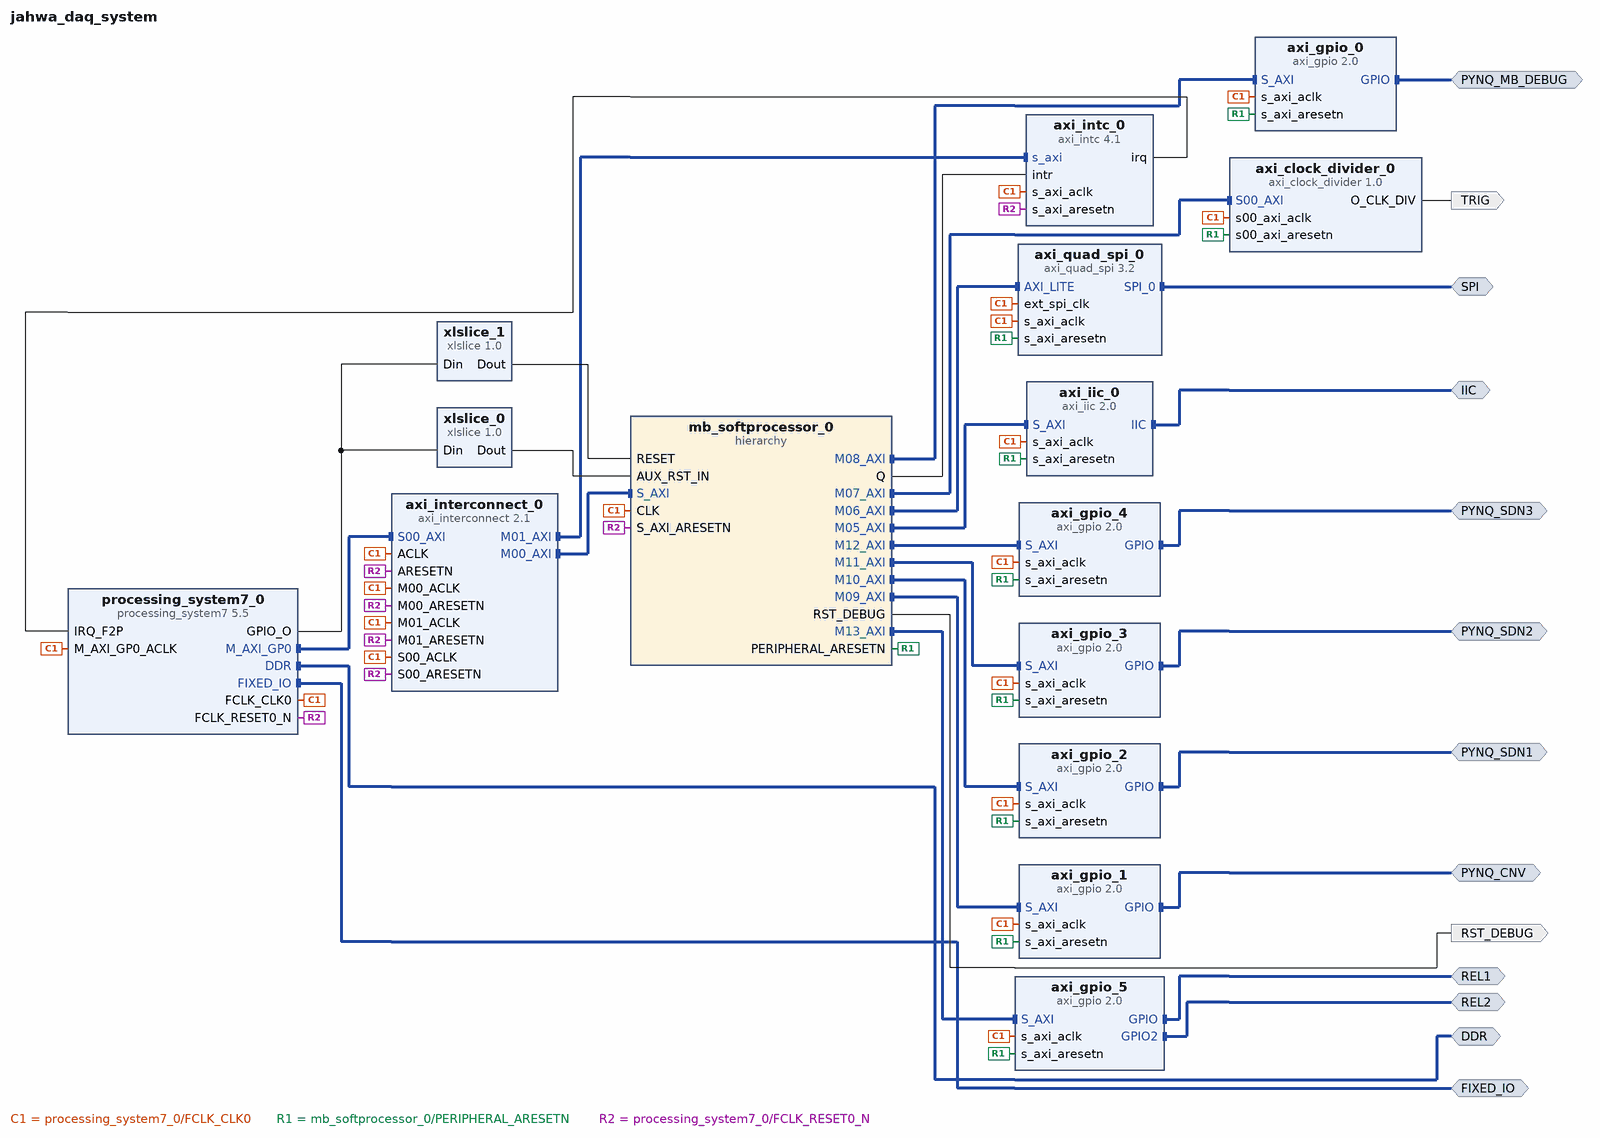
[diagram p0: block diagram of the top level]
# Vivado block design jahwa_daq_system, xc7z020clg400-1, Vivado 2020.2
create_bd_design jahwa_daq_system

create_bd_intf_port -mode Master -vlnv xilinx.com:interface:ddrx_rtl:1.0 DDR
create_bd_intf_port -mode Master -vlnv xilinx.com:display_processing_system7:fixedio_rtl:1.0 FIXED_IO
create_bd_intf_port -mode Master -vlnv xilinx.com:interface:spi_rtl:1.0 SPI
create_bd_intf_port -mode Master -vlnv xilinx.com:interface:iic_rtl:1.0 IIC
create_bd_intf_port -mode Master -vlnv xilinx.com:interface:gpio_rtl:1.0 PYNQ_CNV
create_bd_intf_port -mode Master -vlnv xilinx.com:interface:gpio_rtl:1.0 PYNQ_SDN1
create_bd_intf_port -mode Master -vlnv xilinx.com:interface:gpio_rtl:1.0 PYNQ_SDN2
create_bd_intf_port -mode Master -vlnv xilinx.com:interface:gpio_rtl:1.0 PYNQ_SDN3
create_bd_intf_port -mode Master -vlnv xilinx.com:interface:gpio_rtl:1.0 REL1
create_bd_intf_port -mode Master -vlnv xilinx.com:interface:gpio_rtl:1.0 REL2
create_bd_intf_port -mode Master -vlnv xilinx.com:interface:gpio_rtl:1.0 PYNQ_MB_DEBUG
create_bd_port -dir O RST_DEBUG
create_bd_port -dir O TRIG

create_bd_cell -type ip -vlnv xilinx.com:ip:processing_system7:5.5 processing_system7_0
set_property -dict [list \
  CONFIG.PCW_APU_PERIPHERAL_FREQMHZ 650 \
  CONFIG.PCW_CRYSTAL_PERIPHERAL_FREQMHZ 50 \
  CONFIG.PCW_ENET0_ENET0_IO {MIO 16 .. 27} \
  CONFIG.PCW_ENET0_GRP_MDIO_ENABLE 1 \
  CONFIG.PCW_ENET0_GRP_MDIO_IO {MIO 52 .. 53} \
  CONFIG.PCW_ENET0_PERIPHERAL_ENABLE 1 \
  CONFIG.PCW_ENET0_RESET_ENABLE 1 \
  CONFIG.PCW_ENET0_RESET_IO {MIO 9} \
  CONFIG.PCW_ENET_RESET_ENABLE 1 \
  CONFIG.PCW_ENET_RESET_SELECT {Share reset pin} \
  CONFIG.PCW_FPGA0_PERIPHERAL_FREQMHZ 100 \
  CONFIG.PCW_FPGA1_PERIPHERAL_FREQMHZ 50 \
  CONFIG.PCW_GPIO_EMIO_GPIO_ENABLE 1 \
  CONFIG.PCW_GPIO_EMIO_GPIO_IO 2 \
  CONFIG.PCW_GPIO_EMIO_GPIO_WIDTH 2 \
  CONFIG.PCW_GPIO_MIO_GPIO_ENABLE 1 \
  CONFIG.PCW_GPIO_MIO_GPIO_IO MIO \
  CONFIG.PCW_I2C_RESET_ENABLE 1 \
  CONFIG.PCW_IRQ_F2P_INTR 1 \
  CONFIG.PCW_M_AXI_GP0_FREQMHZ 10 \
  CONFIG.PCW_PERIPHERAL_BOARD_PRESET None \
  CONFIG.PCW_PRESET_BANK1_VOLTAGE {LVCMOS 1.8V} \
  CONFIG.PCW_QSPI_GRP_FBCLK_ENABLE 1 \
  CONFIG.PCW_QSPI_GRP_FBCLK_IO {MIO 8} \
  CONFIG.PCW_QSPI_GRP_SINGLE_SS_ENABLE 1 \
  CONFIG.PCW_QSPI_GRP_SINGLE_SS_IO {MIO 1 .. 6} \
  CONFIG.PCW_QSPI_PERIPHERAL_ENABLE 1 \
  CONFIG.PCW_QSPI_QSPI_IO {MIO 1 .. 6} \
  CONFIG.PCW_SD0_GRP_CD_ENABLE 1 \
  CONFIG.PCW_SD0_GRP_CD_IO {MIO 47} \
  CONFIG.PCW_SD0_GRP_WP_ENABLE 0 \
  CONFIG.PCW_SD0_PERIPHERAL_ENABLE 1 \
  CONFIG.PCW_SD0_SD0_IO {MIO 40 .. 45} \
  CONFIG.PCW_SDIO_PERIPHERAL_FREQMHZ 50 \
  CONFIG.PCW_SINGLE_QSPI_DATA_MODE x4 \
  CONFIG.PCW_UART0_PERIPHERAL_ENABLE 1 \
  CONFIG.PCW_UART0_UART0_IO {MIO 14 .. 15} \
  CONFIG.PCW_UART1_PERIPHERAL_ENABLE 0 \
  CONFIG.PCW_UART_PERIPHERAL_FREQMHZ 100 \
  CONFIG.PCW_UIPARAM_DDR_BUS_WIDTH {16 Bit} \
  CONFIG.PCW_UIPARAM_DDR_FREQ_MHZ 525 \
  CONFIG.PCW_UIPARAM_DDR_PARTNO {MT41J256M16 RE-125} \
  CONFIG.PCW_USB0_PERIPHERAL_ENABLE 1 \
  CONFIG.PCW_USB0_RESET_ENABLE 1 \
  CONFIG.PCW_USB0_RESET_IO {MIO 46} \
  CONFIG.PCW_USB0_USB0_IO {MIO 28 .. 39} \
  CONFIG.PCW_USB_RESET_ENABLE 1 \
  CONFIG.PCW_USB_RESET_SELECT {Share reset pin} \
  CONFIG.PCW_USE_FABRIC_INTERRUPT 1 \
] [get_bd_cells processing_system7_0]
# 490 more settings of processing_system7_0 are not shown: defaults, MIO pin electricals, DDR timing, and values the tool derives
create_bd_cell -type ip -vlnv xilinx.com:ip:axi_intc:4.1 axi_intc_0
create_bd_cell -type ip -vlnv xilinx.com:ip:axi_iic:2.0 axi_iic_0
set_property -dict {CONFIG.C_SDA_LEVEL 0 CONFIG.IIC_FREQ_KHZ 1000} [get_bd_cells axi_iic_0]
create_bd_cell -type ip -vlnv xilinx.com:ip:axi_quad_spi:3.2 axi_quad_spi_0
set_property -dict [list \
  CONFIG.C_NUM_SS_BITS 2 \
  CONFIG.C_NUM_TRANSFER_BITS 16 \
  CONFIG.C_SCK_RATIO 16 \
  CONFIG.C_USE_STARTUP 0 \
] [get_bd_cells axi_quad_spi_0]
create_bd_cell -type ip -vlnv xilinx.com:ip:axi_gpio:2.0 axi_gpio_0
set_property -dict {CONFIG.C_ALL_OUTPUTS 1 CONFIG.C_GPIO_WIDTH 4} [get_bd_cells axi_gpio_0]
create_bd_cell -type ip -vlnv xilinx.com:ip:axi_gpio:2.0 axi_gpio_1
set_property -dict {CONFIG.C_ALL_OUTPUTS 1 CONFIG.C_GPIO_WIDTH 1} [get_bd_cells axi_gpio_1]
create_bd_cell -type ip -vlnv xilinx.com:ip:axi_gpio:2.0 axi_gpio_2
set_property -dict {CONFIG.C_ALL_OUTPUTS 1 CONFIG.C_GPIO_WIDTH 1} [get_bd_cells axi_gpio_2]
create_bd_cell -type ip -vlnv xilinx.com:ip:axi_gpio:2.0 axi_gpio_3
set_property -dict {CONFIG.C_ALL_OUTPUTS 1 CONFIG.C_GPIO_WIDTH 1} [get_bd_cells axi_gpio_3]
create_bd_cell -type ip -vlnv xilinx.com:ip:axi_gpio:2.0 axi_gpio_4
set_property -dict {CONFIG.C_ALL_OUTPUTS 1 CONFIG.C_GPIO_WIDTH 1} [get_bd_cells axi_gpio_4]
create_bd_cell -type ip -vlnv xilinx.com:ip:axi_gpio:2.0 axi_gpio_5
set_property -dict [list \
  CONFIG.C_ALL_OUTPUTS 1 \
  CONFIG.C_ALL_OUTPUTS_2 1 \
  CONFIG.C_GPIO2_WIDTH 1 \
  CONFIG.C_GPIO_WIDTH 1 \
  CONFIG.C_IS_DUAL 1 \
] [get_bd_cells axi_gpio_5]
create_bd_cell -type ip -vlnv xilinx.com:ip:axi_interconnect:2.1 axi_interconnect_0
set_property -dict {CONFIG.NUM_MI 2} [get_bd_cells axi_interconnect_0]
create_bd_cell -type ip -vlnv xilinx.com:ip:xlslice:1.0 xlslice_0
set_property -dict {CONFIG.DIN_WIDTH 2} [get_bd_cells xlslice_0]
create_bd_cell -type ip -vlnv xilinx.com:ip:xlslice:1.0 xlslice_1
set_property -dict {CONFIG.DIN_FROM 1 CONFIG.DIN_TO 1 CONFIG.DIN_WIDTH 2} [get_bd_cells xlslice_1]
create_bd_cell -type hier mb_softprocessor_0
create_bd_cell -type ip -vlnv xilinx.com:user:axi_clock_divider:1.0 axi_clock_divider_0

# ---- hierarchy /mb_softprocessor_0 ----
current_bd_instance /mb_softprocessor_0
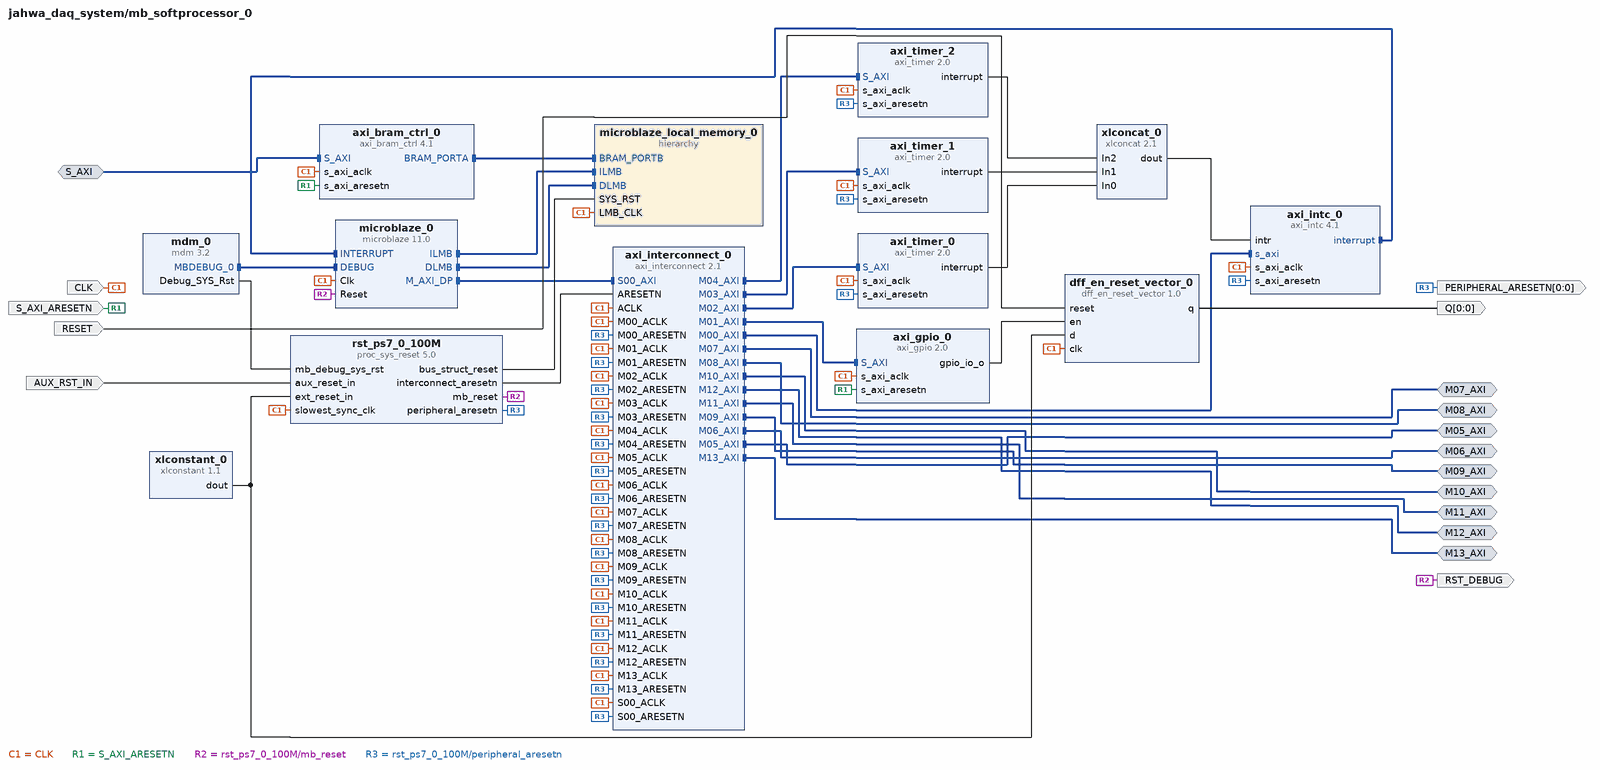
[diagram p1: block diagram inside /mb_softprocessor_0]
create_bd_intf_pin -mode Slave -vlnv xilinx.com:interface:aximm_rtl:1.0 S_AXI
create_bd_intf_pin -mode Master -vlnv xilinx.com:interface:aximm_rtl:1.0 M05_AXI
create_bd_intf_pin -mode Master -vlnv xilinx.com:interface:aximm_rtl:1.0 M06_AXI
create_bd_intf_pin -mode Master -vlnv xilinx.com:interface:aximm_rtl:1.0 M07_AXI
create_bd_intf_pin -mode Master -vlnv xilinx.com:interface:aximm_rtl:1.0 M08_AXI
create_bd_intf_pin -mode Master -vlnv xilinx.com:interface:aximm_rtl:1.0 M09_AXI
create_bd_intf_pin -mode Master -vlnv xilinx.com:interface:aximm_rtl:1.0 M10_AXI
create_bd_intf_pin -mode Master -vlnv xilinx.com:interface:aximm_rtl:1.0 M11_AXI
create_bd_intf_pin -mode Master -vlnv xilinx.com:interface:aximm_rtl:1.0 M12_AXI
create_bd_intf_pin -mode Master -vlnv xilinx.com:interface:aximm_rtl:1.0 M13_AXI
create_bd_pin -dir I RESET
create_bd_pin -dir I -type clk CLK
create_bd_pin -dir I -type rst AUX_RST_IN
create_bd_pin -dir I -type rst S_AXI_ARESETN
create_bd_pin -dir O -from 0 -to 0 Q
create_bd_pin -dir O -type rst RST_DEBUG
create_bd_pin -dir O -from 0 -to 0 -type rst PERIPHERAL_ARESETN

create_bd_cell -type ip -vlnv xilinx.com:ip:axi_bram_ctrl:4.1 axi_bram_ctrl_0
set_property -dict {CONFIG.READ_LATENCY 1 CONFIG.SINGLE_PORT_BRAM 1} [get_bd_cells axi_bram_ctrl_0]
create_bd_cell -type ip -vlnv xilinx.com:ip:axi_gpio:2.0 axi_gpio_0
set_property -dict {CONFIG.C_ALL_OUTPUTS 1 CONFIG.C_GPIO_WIDTH 1 CONFIG.C_IS_DUAL 0} [get_bd_cells axi_gpio_0]
create_bd_cell -type ip -vlnv xilinx.com:ip:axi_timer:2.0 axi_timer_0
set_property -dict {CONFIG.enable_timer2 1} [get_bd_cells axi_timer_0]
create_bd_cell -type ip -vlnv xilinx.com:ip:axi_timer:2.0 axi_timer_1
set_property -dict {CONFIG.enable_timer2 1} [get_bd_cells axi_timer_1]
create_bd_cell -type ip -vlnv xilinx.com:ip:axi_timer:2.0 axi_timer_2
set_property -dict {CONFIG.mode_64bit 1} [get_bd_cells axi_timer_2]
create_bd_cell -type ip -vlnv xilinx.com:ip:xlconcat:2.1 xlconcat_0
set_property -dict {CONFIG.NUM_PORTS 3} [get_bd_cells xlconcat_0]
create_bd_cell -type ip -vlnv xilinx.com:ip:axi_intc:4.1 axi_intc_0
create_bd_cell -type ip -vlnv xilinx.com:ip:axi_interconnect:2.1 axi_interconnect_0
set_property -dict {CONFIG.NUM_MI 14} [get_bd_cells axi_interconnect_0]
create_bd_cell -type ip -vlnv xilinx.com:user:dff_en_reset_vector:1.0 dff_en_reset_vector_0
set_property -dict {CONFIG.SIZE 1} [get_bd_cells dff_en_reset_vector_0]
create_bd_cell -type ip -vlnv xilinx.com:ip:mdm:3.2 mdm_0
create_bd_cell -type ip -vlnv xilinx.com:ip:microblaze:11.0 microblaze_0
set_property -dict [list \
  CONFIG.C_ADDR_TAG_BITS 0 \
  CONFIG.C_DCACHE_ADDR_TAG 0 \
  CONFIG.C_DEBUG_ENABLED 1 \
  CONFIG.C_D_AXI 1 \
  CONFIG.C_D_LMB 1 \
  CONFIG.C_I_LMB 1 \
  CONFIG.C_USE_DCACHE 0 \
  CONFIG.C_USE_ICACHE 0 \
] [get_bd_cells microblaze_0]
create_bd_cell -type ip -vlnv xilinx.com:ip:proc_sys_reset:5.0 rst_ps7_0_100M
set_property -dict {CONFIG.C_AUX_RESET_HIGH 1} [get_bd_cells rst_ps7_0_100M]
create_bd_cell -type ip -vlnv xilinx.com:ip:xlconstant:1.1 xlconstant_0
set_property -dict {CONFIG.CONST_VAL 1} [get_bd_cells xlconstant_0]
create_bd_cell -type hier microblaze_local_memory_0

# ---- hierarchy /mb_softprocessor_0/microblaze_local_memory_0 ----
current_bd_instance /mb_softprocessor_0/microblaze_local_memory_0
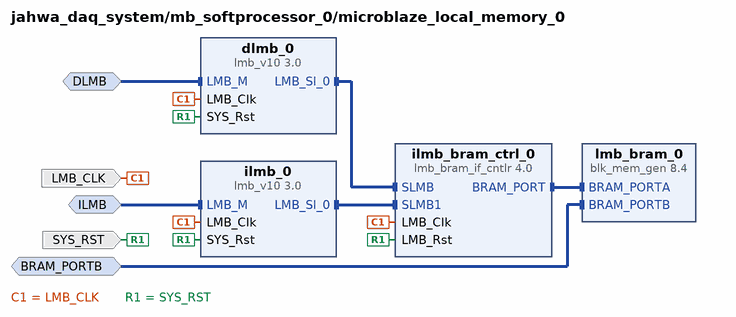
[diagram p2: block diagram inside /mb_softprocessor_0/microblaze_local_memory_0]
create_bd_intf_pin -mode Slave -vlnv xilinx.com:interface:bram_rtl:1.0 BRAM_PORTB
create_bd_intf_pin -mode MirroredMaster -vlnv xilinx.com:interface:lmb_rtl:1.0 DLMB
create_bd_intf_pin -mode MirroredMaster -vlnv xilinx.com:interface:lmb_rtl:1.0 ILMB
create_bd_pin -dir I -type clk LMB_CLK
create_bd_pin -dir I -type rst SYS_RST

create_bd_cell -type ip -vlnv xilinx.com:ip:lmb_v10:3.0 dlmb_0
create_bd_cell -type ip -vlnv xilinx.com:ip:lmb_v10:3.0 ilmb_0
create_bd_cell -type ip -vlnv xilinx.com:ip:lmb_bram_if_cntlr:4.0 ilmb_bram_ctrl_0
set_property -dict {CONFIG.C_ECC 0 CONFIG.C_NUM_LMB 2} [get_bd_cells ilmb_bram_ctrl_0]
create_bd_cell -type ip -vlnv xilinx.com:ip:blk_mem_gen:8.4 lmb_bram_0
set_property -dict [list \
  CONFIG.EN_SAFETY_CKT true \
  CONFIG.Enable_32bit_Address true \
  CONFIG.Memory_Type True_Dual_Port_RAM \
  CONFIG.Register_PortA_Output_of_Memory_Primitives false \
  CONFIG.Register_PortB_Output_of_Memory_Primitives false \
  CONFIG.Use_RSTA_Pin true \
  CONFIG.Use_RSTB_Pin true \
  CONFIG.use_bram_block BRAM_Controller \
] [get_bd_cells lmb_bram_0]

# ---- connections ----

current_bd_instance /mb_softprocessor_0
connect_bd_intf_net -intf_net conn_m07_axi [get_bd_intf_pins M07_AXI] [get_bd_intf_pins axi_interconnect_0/M07_AXI]
connect_bd_intf_net -intf_net conn_m08_axi [get_bd_intf_pins M08_AXI] [get_bd_intf_pins axi_interconnect_0/M08_AXI]
connect_bd_intf_net [get_bd_intf_pins axi_intc_0/interrupt] [get_bd_intf_pins microblaze_0/INTERRUPT]
connect_bd_intf_net -intf_net conn_m12_axi [get_bd_intf_pins M12_AXI] [get_bd_intf_pins axi_interconnect_0/M12_AXI]
connect_bd_intf_net -intf_net conn_m10_axi [get_bd_intf_pins M10_AXI] [get_bd_intf_pins axi_interconnect_0/M10_AXI]
connect_bd_intf_net [get_bd_intf_pins microblaze_0/DEBUG] [get_bd_intf_pins mdm_0/MBDEBUG_0]
connect_bd_intf_net -intf_net mb_axi_interconnect_0_M02_AXI [get_bd_intf_pins axi_timer_0/S_AXI] [get_bd_intf_pins axi_interconnect_0/M02_AXI]
connect_bd_intf_net -intf_net conn_m11_axi [get_bd_intf_pins M11_AXI] [get_bd_intf_pins axi_interconnect_0/M11_AXI]
connect_bd_intf_net -intf_net mb_axi_interconnect_0_M00_AXI [get_bd_intf_pins axi_intc_0/s_axi] [get_bd_intf_pins axi_interconnect_0/M00_AXI]
connect_bd_intf_net [get_bd_intf_pins microblaze_0/ILMB] [get_bd_intf_pins microblaze_local_memory_0/ILMB]
connect_bd_intf_net -intf_net mb_axi_interconnect_0_M03_AXI [get_bd_intf_pins axi_timer_1/S_AXI] [get_bd_intf_pins axi_interconnect_0/M03_AXI]
connect_bd_intf_net -intf_net mb_M_AXI_DP [get_bd_intf_pins microblaze_0/M_AXI_DP] [get_bd_intf_pins axi_interconnect_0/S00_AXI]
connect_bd_intf_net -intf_net conn_m09_axi [get_bd_intf_pins M09_AXI] [get_bd_intf_pins axi_interconnect_0/M09_AXI]
connect_bd_intf_net -intf_net conn_m06_axi [get_bd_intf_pins M06_AXI] [get_bd_intf_pins axi_interconnect_0/M06_AXI]
connect_bd_intf_net -intf_net conn_m13_axi [get_bd_intf_pins M13_AXI] [get_bd_intf_pins axi_interconnect_0/M13_AXI]
connect_bd_intf_net -intf_net conn_m05_axi [get_bd_intf_pins M05_AXI] [get_bd_intf_pins axi_interconnect_0/M05_AXI]
connect_bd_intf_net -intf_net zynq_axi_interconnect_0_M00_AXI [get_bd_intf_pins S_AXI] [get_bd_intf_pins axi_bram_ctrl_0/S_AXI]
connect_bd_intf_net [get_bd_intf_pins axi_bram_ctrl_0/BRAM_PORTA] [get_bd_intf_pins microblaze_local_memory_0/BRAM_PORTB]
connect_bd_intf_net [get_bd_intf_pins microblaze_0/DLMB] [get_bd_intf_pins microblaze_local_memory_0/DLMB]
connect_bd_intf_net -intf_net mb_axi_interconnect_0_M01_AXI [get_bd_intf_pins axi_gpio_0/S_AXI] [get_bd_intf_pins axi_interconnect_0/M01_AXI]
connect_bd_intf_net -intf_net mb_axi_interconnect_0_M04_AXI [get_bd_intf_pins axi_timer_2/S_AXI] [get_bd_intf_pins axi_interconnect_0/M04_AXI]
connect_bd_net -net softprocessor_clk [get_bd_pins CLK] \
  [get_bd_pins axi_interconnect_0/ACLK] [get_bd_pins axi_interconnect_0/S00_ACLK] [get_bd_pins axi_interconnect_0/M00_ACLK] \
  [get_bd_pins axi_interconnect_0/M01_ACLK] [get_bd_pins axi_interconnect_0/M02_ACLK] \
  [get_bd_pins axi_interconnect_0/M03_ACLK] [get_bd_pins axi_interconnect_0/M04_ACLK] \
  [get_bd_pins axi_interconnect_0/M05_ACLK] [get_bd_pins axi_interconnect_0/M06_ACLK] \
  [get_bd_pins axi_interconnect_0/M07_ACLK] [get_bd_pins axi_interconnect_0/M08_ACLK] \
  [get_bd_pins axi_interconnect_0/M09_ACLK] [get_bd_pins axi_interconnect_0/M10_ACLK] \
  [get_bd_pins axi_interconnect_0/M11_ACLK] [get_bd_pins axi_interconnect_0/M12_ACLK] \
  [get_bd_pins axi_interconnect_0/M13_ACLK] [get_bd_pins microblaze_0/Clk] [get_bd_pins axi_timer_0/s_axi_aclk] \
  [get_bd_pins axi_timer_1/s_axi_aclk] [get_bd_pins axi_timer_2/s_axi_aclk] [get_bd_pins dff_en_reset_vector_0/clk] \
  [get_bd_pins axi_bram_ctrl_0/s_axi_aclk] [get_bd_pins rst_ps7_0_100M/slowest_sync_clk] \
  [get_bd_pins microblaze_local_memory_0/LMB_CLK] [get_bd_pins axi_gpio_0/s_axi_aclk] [get_bd_pins axi_intc_0/s_axi_aclk]
connect_bd_net -net axi_rstn [get_bd_pins S_AXI_ARESETN] [get_bd_pins axi_gpio_0/s_axi_aresetn] [get_bd_pins axi_bram_ctrl_0/s_axi_aresetn]
connect_bd_net -net sys_rst_1 [get_bd_pins rst_ps7_0_100M/bus_struct_reset] [get_bd_pins microblaze_local_memory_0/SYS_RST]
connect_bd_net [get_bd_pins AUX_RST_IN] [get_bd_pins rst_ps7_0_100M/aux_reset_in]
connect_bd_net -net dff_en_reset_vector_0_en [get_bd_pins axi_gpio_0/gpio_io_o] [get_bd_pins dff_en_reset_vector_0/en]
connect_bd_net [get_bd_pins dff_en_reset_vector_0/q] [get_bd_pins Q]
connect_bd_net [get_bd_pins RESET] [get_bd_pins dff_en_reset_vector_0/reset]
connect_bd_net -net mdm_debug_sys_rst_1 [get_bd_pins mdm_0/Debug_SYS_Rst] [get_bd_pins rst_ps7_0_100M/mb_debug_sys_rst]
connect_bd_net [get_bd_pins rst_ps7_0_100M/interconnect_aresetn] [get_bd_pins axi_interconnect_0/ARESETN]
connect_bd_net [get_bd_pins rst_ps7_0_100M/mb_reset] [get_bd_pins RST_DEBUG] [get_bd_pins microblaze_0/Reset]
connect_bd_net [get_bd_pins rst_ps7_0_100M/peripheral_aresetn] \
  [get_bd_pins PERIPHERAL_ARESETN] [get_bd_pins axi_intc_0/s_axi_aresetn] [get_bd_pins axi_interconnect_0/S00_ARESETN] \
  [get_bd_pins axi_interconnect_0/M00_ARESETN] [get_bd_pins axi_interconnect_0/M01_ARESETN] \
  [get_bd_pins axi_interconnect_0/M02_ARESETN] [get_bd_pins axi_interconnect_0/M03_ARESETN] \
  [get_bd_pins axi_interconnect_0/M04_ARESETN] [get_bd_pins axi_interconnect_0/M05_ARESETN] \
  [get_bd_pins axi_interconnect_0/M06_ARESETN] [get_bd_pins axi_interconnect_0/M07_ARESETN] \
  [get_bd_pins axi_interconnect_0/M08_ARESETN] [get_bd_pins axi_interconnect_0/M09_ARESETN] \
  [get_bd_pins axi_interconnect_0/M10_ARESETN] [get_bd_pins axi_interconnect_0/M11_ARESETN] \
  [get_bd_pins axi_interconnect_0/M12_ARESETN] [get_bd_pins axi_interconnect_0/M13_ARESETN] \
  [get_bd_pins axi_timer_0/s_axi_aresetn] [get_bd_pins axi_timer_1/s_axi_aresetn] [get_bd_pins axi_timer_2/s_axi_aresetn]
connect_bd_net -net axi_timer_0_intr [get_bd_pins axi_timer_0/interrupt] [get_bd_pins xlconcat_0/In0]
connect_bd_net -net axi_timer_1_intr [get_bd_pins axi_timer_1/interrupt] [get_bd_pins xlconcat_0/In1]
connect_bd_net -net axi_timer_2_intr [get_bd_pins axi_timer_2/interrupt] [get_bd_pins xlconcat_0/In2]
connect_bd_net [get_bd_pins xlconcat_0/dout] [get_bd_pins axi_intc_0/intr]
connect_bd_net [get_bd_pins xlconstant_0/dout] [get_bd_pins dff_en_reset_vector_0/d] [get_bd_pins rst_ps7_0_100M/ext_reset_in]
set_property HDL_ATTRIBUTE.BMM_INFO_ADDRESS_SPACE {byte  0x40000000 32 > jahwa_daq_system mb_softprocessor_0/microblaze_local_memory_0/lmb_bram_0} [get_bd_cells axi_bram_ctrl_0]
set_property HDL_ATTRIBUTE.KEEP_HIERARCHY yes [get_bd_cells axi_bram_ctrl_0]
set_property HDL_ATTRIBUTE.BMM_INFO_PROCESSOR {microblaze-le > jahwa_daq_system mb_softprocessor_0/microblaze_local_memory_0/ilmb_bram_ctrl_0} [get_bd_cells microblaze_0]
set_property HDL_ATTRIBUTE.KEEP_HIERARCHY yes [get_bd_cells microblaze_0]

current_bd_instance /mb_softprocessor_0/microblaze_local_memory_0
connect_bd_intf_net [get_bd_intf_pins ilmb_bram_ctrl_0/SLMB] [get_bd_intf_pins dlmb_0/LMB_Sl_0]
connect_bd_intf_net [get_bd_intf_pins DLMB] [get_bd_intf_pins dlmb_0/LMB_M]
connect_bd_intf_net [get_bd_intf_pins ilmb_bram_ctrl_0/SLMB1] [get_bd_intf_pins ilmb_0/LMB_Sl_0]
connect_bd_intf_net [get_bd_intf_pins ilmb_bram_ctrl_0/BRAM_PORT] [get_bd_intf_pins lmb_bram_0/BRAM_PORTA]
connect_bd_intf_net [get_bd_intf_pins ILMB] [get_bd_intf_pins ilmb_0/LMB_M]
connect_bd_intf_net [get_bd_intf_pins BRAM_PORTB] [get_bd_intf_pins lmb_bram_0/BRAM_PORTB]
connect_bd_net -net microblaze_0_clk [get_bd_pins LMB_CLK] \
  [get_bd_pins dlmb_0/LMB_Clk] [get_bd_pins ilmb_0/LMB_Clk] [get_bd_pins ilmb_bram_ctrl_0/LMB_Clk]
connect_bd_net [get_bd_pins SYS_RST] [get_bd_pins dlmb_0/SYS_Rst] [get_bd_pins ilmb_0/SYS_Rst] [get_bd_pins ilmb_bram_ctrl_0/LMB_Rst]
set_property HDL_ATTRIBUTE.BMM_INFO_ADDRESS_SPACE {byte  0x00000000 32 > jahwa_daq_system mb_softprocessor_0/microblaze_local_memory_0/lmb_bram_0} [get_bd_cells ilmb_bram_ctrl_0]
set_property HDL_ATTRIBUTE.KEEP_HIERARCHY yes [get_bd_cells ilmb_bram_ctrl_0]

current_bd_instance /
connect_bd_intf_net [get_bd_intf_ports PYNQ_CNV] [get_bd_intf_pins axi_gpio_1/GPIO]
connect_bd_intf_net [get_bd_intf_ports DDR] [get_bd_intf_pins processing_system7_0/DDR]
connect_bd_intf_net -intf_net softprocessor_M07_axi [get_bd_intf_pins mb_softprocessor_0/M07_AXI] [get_bd_intf_pins axi_clock_divider_0/S00_AXI]
connect_bd_intf_net -intf_net softprocessor_M11_axi [get_bd_intf_pins mb_softprocessor_0/M11_AXI] [get_bd_intf_pins axi_gpio_3/S_AXI]
connect_bd_intf_net -intf_net softprocessor_M06_axi [get_bd_intf_pins mb_softprocessor_0/M06_AXI] [get_bd_intf_pins axi_quad_spi_0/AXI_LITE]
connect_bd_intf_net [get_bd_intf_ports PYNQ_SDN1] [get_bd_intf_pins axi_gpio_2/GPIO]
connect_bd_intf_net [get_bd_intf_ports PYNQ_SDN3] [get_bd_intf_pins axi_gpio_4/GPIO]
connect_bd_intf_net [get_bd_intf_ports PYNQ_SDN2] [get_bd_intf_pins axi_gpio_3/GPIO]
connect_bd_intf_net -intf_net softprocessor_M13_axi [get_bd_intf_pins mb_softprocessor_0/M13_AXI] [get_bd_intf_pins axi_gpio_5/S_AXI]
connect_bd_intf_net -intf_net softprocessor_M08_axi [get_bd_intf_pins mb_softprocessor_0/M08_AXI] [get_bd_intf_pins axi_gpio_0/S_AXI]
connect_bd_intf_net -intf_net zynq_axi_interconnect_0_M00_AXI [get_bd_intf_pins axi_interconnect_0/M00_AXI] [get_bd_intf_pins mb_softprocessor_0/S_AXI]
connect_bd_intf_net -intf_net zynq_axi_interconnect_0_M01_AXI [get_bd_intf_pins axi_interconnect_0/M01_AXI] [get_bd_intf_pins axi_intc_0/s_axi]
connect_bd_intf_net [get_bd_intf_pins axi_interconnect_0/S00_AXI] [get_bd_intf_pins processing_system7_0/M_AXI_GP0]
connect_bd_intf_net -intf_net softprocessor_M05_axi [get_bd_intf_pins mb_softprocessor_0/M05_AXI] [get_bd_intf_pins axi_iic_0/S_AXI]
connect_bd_intf_net [get_bd_intf_ports PYNQ_MB_DEBUG] [get_bd_intf_pins axi_gpio_0/GPIO]
connect_bd_intf_net [get_bd_intf_ports IIC] [get_bd_intf_pins axi_iic_0/IIC]
connect_bd_intf_net [get_bd_intf_ports SPI] [get_bd_intf_pins axi_quad_spi_0/SPI_0]
connect_bd_intf_net -intf_net softprocessor_M12_axi [get_bd_intf_pins mb_softprocessor_0/M12_AXI] [get_bd_intf_pins axi_gpio_4/S_AXI]
connect_bd_intf_net -intf_net softprocessor_M09_axi [get_bd_intf_pins mb_softprocessor_0/M09_AXI] [get_bd_intf_pins axi_gpio_1/S_AXI]
connect_bd_intf_net [get_bd_intf_ports FIXED_IO] [get_bd_intf_pins processing_system7_0/FIXED_IO]
connect_bd_intf_net [get_bd_intf_ports REL1] [get_bd_intf_pins axi_gpio_5/GPIO]
connect_bd_intf_net [get_bd_intf_ports REL2] [get_bd_intf_pins axi_gpio_5/GPIO2]
connect_bd_intf_net -intf_net softprocessor_M10_axi [get_bd_intf_pins mb_softprocessor_0/M10_AXI] [get_bd_intf_pins axi_gpio_2/S_AXI]
connect_bd_net -net softprocessor_clk [get_bd_pins processing_system7_0/FCLK_CLK0] \
  [get_bd_pins mb_softprocessor_0/CLK] [get_bd_pins axi_iic_0/s_axi_aclk] [get_bd_pins axi_intc_0/s_axi_aclk] \
  [get_bd_pins axi_gpio_0/s_axi_aclk] [get_bd_pins axi_gpio_1/s_axi_aclk] [get_bd_pins axi_gpio_2/s_axi_aclk] \
  [get_bd_pins axi_gpio_3/s_axi_aclk] [get_bd_pins axi_gpio_4/s_axi_aclk] [get_bd_pins axi_gpio_5/s_axi_aclk] \
  [get_bd_pins axi_quad_spi_0/s_axi_aclk] [get_bd_pins axi_quad_spi_0/ext_spi_clk] [get_bd_pins axi_interconnect_0/ACLK] \
  [get_bd_pins axi_interconnect_0/M00_ACLK] [get_bd_pins axi_interconnect_0/M01_ACLK] \
  [get_bd_pins axi_interconnect_0/S00_ACLK] [get_bd_pins processing_system7_0/M_AXI_GP0_ACLK] \
  [get_bd_pins axi_clock_divider_0/s00_axi_aclk]
connect_bd_net [get_bd_pins mb_softprocessor_0/RST_DEBUG] [get_bd_ports RST_DEBUG]
connect_bd_net [get_bd_pins axi_clock_divider_0/O_CLK_DIV] [get_bd_ports TRIG]
connect_bd_net [get_bd_pins mb_softprocessor_0/PERIPHERAL_ARESETN] \
  [get_bd_pins axi_iic_0/s_axi_aresetn] [get_bd_pins axi_quad_spi_0/s_axi_aresetn] [get_bd_pins axi_gpio_0/s_axi_aresetn] \
  [get_bd_pins axi_gpio_1/s_axi_aresetn] [get_bd_pins axi_gpio_2/s_axi_aresetn] [get_bd_pins axi_gpio_3/s_axi_aresetn] \
  [get_bd_pins axi_gpio_4/s_axi_aresetn] [get_bd_pins axi_gpio_5/s_axi_aresetn] \
  [get_bd_pins axi_clock_divider_0/s00_axi_aresetn]
connect_bd_net [get_bd_pins mb_softprocessor_0/Q] [get_bd_pins axi_intc_0/intr]
connect_bd_net [get_bd_pins xlslice_1/Dout] [get_bd_pins mb_softprocessor_0/RESET]
connect_bd_net [get_bd_pins xlslice_0/Dout] [get_bd_pins mb_softprocessor_0/AUX_RST_IN]
connect_bd_net -net S_AXI_ARESETN_1 [get_bd_pins processing_system7_0/FCLK_RESET0_N] \
  [get_bd_pins mb_softprocessor_0/S_AXI_ARESETN] [get_bd_pins axi_intc_0/s_axi_aresetn] \
  [get_bd_pins axi_interconnect_0/ARESETN] [get_bd_pins axi_interconnect_0/M00_ARESETN] \
  [get_bd_pins axi_interconnect_0/M01_ARESETN] [get_bd_pins axi_interconnect_0/S00_ARESETN]
connect_bd_net [get_bd_pins processing_system7_0/GPIO_O] [get_bd_pins xlslice_0/Din] [get_bd_pins xlslice_1/Din]
connect_bd_net [get_bd_pins axi_intc_0/irq] [get_bd_pins processing_system7_0/IRQ_F2P]
set_property HDL_ATTRIBUTE.BMM_INFO_PROCESSOR {arm > jahwa_daq_system mb_softprocessor_0/axi_bram_ctrl_0} [get_bd_cells processing_system7_0]
set_property HDL_ATTRIBUTE.KEEP_HIERARCHY yes [get_bd_cells processing_system7_0]

# ---- address map ----
assign_bd_address -offset 0x00000000 -range 512K -target_address_space [get_bd_addr_spaces mb_softprocessor_0/microblaze_0/Data] [get_bd_addr_segs mb_softprocessor_0/microblaze_local_memory_0/ilmb_bram_ctrl_0/SLMB/Mem]
assign_bd_address -offset 0x40000000 -range 1K -target_address_space [get_bd_addr_spaces mb_softprocessor_0/microblaze_0/Data] [get_bd_addr_segs axi_gpio_0/S_AXI/Reg]
assign_bd_address -offset 0x40000400 -range 1K -target_address_space [get_bd_addr_spaces mb_softprocessor_0/microblaze_0/Data] [get_bd_addr_segs axi_gpio_1/S_AXI/Reg]
assign_bd_address -offset 0x40000800 -range 1K -target_address_space [get_bd_addr_spaces mb_softprocessor_0/microblaze_0/Data] [get_bd_addr_segs axi_gpio_2/S_AXI/Reg]
assign_bd_address -offset 0x40000C00 -range 1K -target_address_space [get_bd_addr_spaces mb_softprocessor_0/microblaze_0/Data] [get_bd_addr_segs axi_gpio_3/S_AXI/Reg]
assign_bd_address -offset 0x40001000 -range 1K -target_address_space [get_bd_addr_spaces mb_softprocessor_0/microblaze_0/Data] [get_bd_addr_segs axi_gpio_4/S_AXI/Reg]
assign_bd_address -offset 0x40001400 -range 1K -target_address_space [get_bd_addr_spaces mb_softprocessor_0/microblaze_0/Data] [get_bd_addr_segs mb_softprocessor_0/axi_intc_0/S_AXI/Reg]
assign_bd_address -offset 0x40001800 -range 1K -target_address_space [get_bd_addr_spaces mb_softprocessor_0/microblaze_0/Data] [get_bd_addr_segs mb_softprocessor_0/axi_timer_0/S_AXI/Reg]
assign_bd_address -offset 0x40001C00 -range 1K -target_address_space [get_bd_addr_spaces mb_softprocessor_0/microblaze_0/Data] [get_bd_addr_segs mb_softprocessor_0/axi_timer_1/S_AXI/Reg]
assign_bd_address -offset 0x40002000 -range 1K -target_address_space [get_bd_addr_spaces mb_softprocessor_0/microblaze_0/Data] [get_bd_addr_segs mb_softprocessor_0/axi_timer_2/S_AXI/Reg]
assign_bd_address -offset 0x40002400 -range 1K -target_address_space [get_bd_addr_spaces mb_softprocessor_0/microblaze_0/Data] [get_bd_addr_segs mb_softprocessor_0/axi_gpio_0/S_AXI/Reg]
assign_bd_address -offset 0x40002800 -range 1K -target_address_space [get_bd_addr_spaces mb_softprocessor_0/microblaze_0/Data] [get_bd_addr_segs axi_clock_divider_0/S00_AXI/S00_AXI_reg]
assign_bd_address -offset 0x40002C00 -range 1K -target_address_space [get_bd_addr_spaces mb_softprocessor_0/microblaze_0/Data] [get_bd_addr_segs axi_gpio_5/S_AXI/Reg]
assign_bd_address -offset 0x40800000 -range 64K -target_address_space [get_bd_addr_spaces mb_softprocessor_0/microblaze_0/Data] [get_bd_addr_segs axi_iic_0/S_AXI/Reg]
assign_bd_address -offset 0x40810000 -range 64K -target_address_space [get_bd_addr_spaces mb_softprocessor_0/microblaze_0/Data] [get_bd_addr_segs axi_quad_spi_0/AXI_LITE/Reg]
assign_bd_address -offset 0x00000000 -range 512K -target_address_space [get_bd_addr_spaces mb_softprocessor_0/microblaze_0/Instruction] [get_bd_addr_segs mb_softprocessor_0/microblaze_local_memory_0/ilmb_bram_ctrl_0/SLMB1/Mem]
assign_bd_address -offset 0x40000000 -range 512K -target_address_space [get_bd_addr_spaces processing_system7_0/Data] [get_bd_addr_segs mb_softprocessor_0/axi_bram_ctrl_0/S_AXI/Mem0]
assign_bd_address -offset 0x41800000 -range 64K -target_address_space [get_bd_addr_spaces processing_system7_0/Data] [get_bd_addr_segs axi_intc_0/S_AXI/Reg]

validate_bd_design
save_bd_design
